# EAGLE design LEDMatrix_connector (EAGLE 6.5.0)
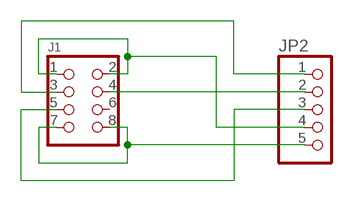
[diagram p0: schematic, sheet 1]

## Parts
J1  CON_HEADER_2X04-SHRD_PTH  [PINSHRD_PTH_2X04]
JP2  PINHD-1X5  [1X05]

## Nets
GND: J1.1 J1.2 JP2.4
N$4: J1.3 JP2.1
N$5: J1.4 JP2.2
N$6: J1.5 JP2.3
VCC: J1.7 J1.8 JP2.5
Unconnected: J1.6

## Library data of the parts
J1 = dp_devices:CON_HEADER_2X04
JP2 = pinhead:PINHD-1X5: PIN HEADER

## Board
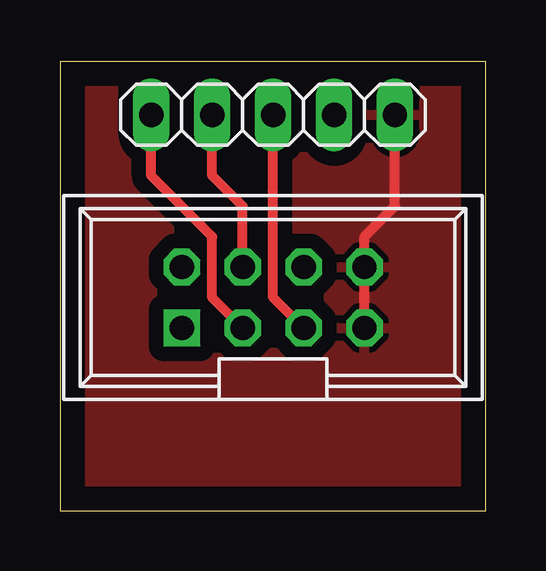
[diagram p1: board, top side]
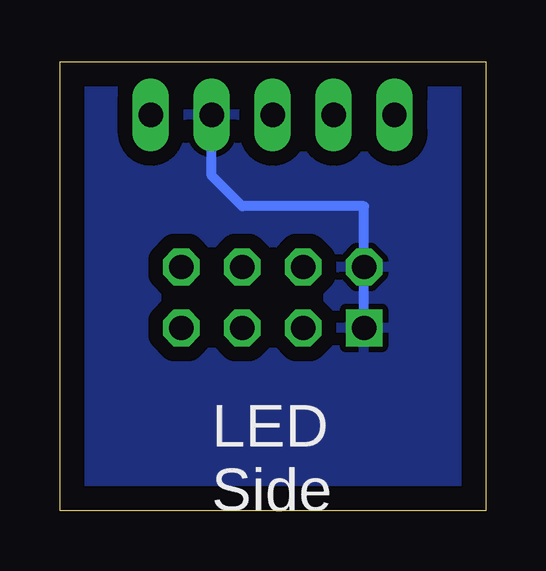
[diagram p2: board, bottom side, seen from below]

Size 17.76 x 18.72 mm. Coordinates in mm from the lower left corner, seen from the top.
Outline: 0,0 17.76,0 17.76,18.72 0,18.72 0,0
Copper layers (1*16): Top 0.035mm / dielectric 1.5mm / Bottom 0.035mm
Design rules "default": minimum track width 10mil, minimum drill 24mil, track to track 8mil, track to pad 8mil, pad to pad 8mil, via to via 8mil, smd to smd 8mil, copper to edge 40mil, drill to drill 8mil, minimum pad ring 10mil, minimum via ring 8mil, stop-mask expansion 4mil, vias tented up to drill 0mil, thermal gap 10mil

### Footprints (pad centres in the part's own frame; a part is rotated, then mirrored left to right if it is on the bottom)
PINSHRD_PTH_2X04 = drill 1.016 square: 1 -3.81,-1.27 | drill 1.016 octagon: 2 -3.81,1.27; 3 -1.27,-1.27; 4 -1.27,1.27; 5 1.27,-1.27; 6 1.27,1.27; 7 3.81,-1.27; 8 3.81,1.27
1X05 = drill 1.016 long: 1 -5.08,0; 2 -2.54,0; 3 0,0; 4 2.54,0; 5 5.08,0

### Placement (x,y rotation side)
J1  8.89,8.89 0 top
JP2  8.89,16.51 0 top

### Tracks (layer width: path | path; a pad name or v marks a point on that pad's centre or on a via)
GND
  Bottom 0.406: J1.1 J1.2 5.08,12.7 10.16,12.7 11.43,13.97 JP2.4
  pour Bottom (isolate 0.61): 0,0 17.78,0 17.78,19.05 0,19.05
N$4
  Top 0.406: J1.3 6.35,8.89 6.35,11.43 3.81,13.97 JP2.1
N$5
  Top 0.406: J1.4 7.62,12.7 6.35,13.97 JP2.2
N$6
  Top 0.406: J1.5 8.89,8.89 JP2.3
VCC
  Top 0.406: J1.7 J1.8 12.7,11.43 13.97,12.7 JP2.5
  pour Top (isolate 0.61): 0,0 17.78,0 17.78,19.05 0,19.05

### Text on the board
bNames: LED / Side
bValues: VCC